# Altium schematic sheet Sheet.SchDoc
size 420 x 297 mm
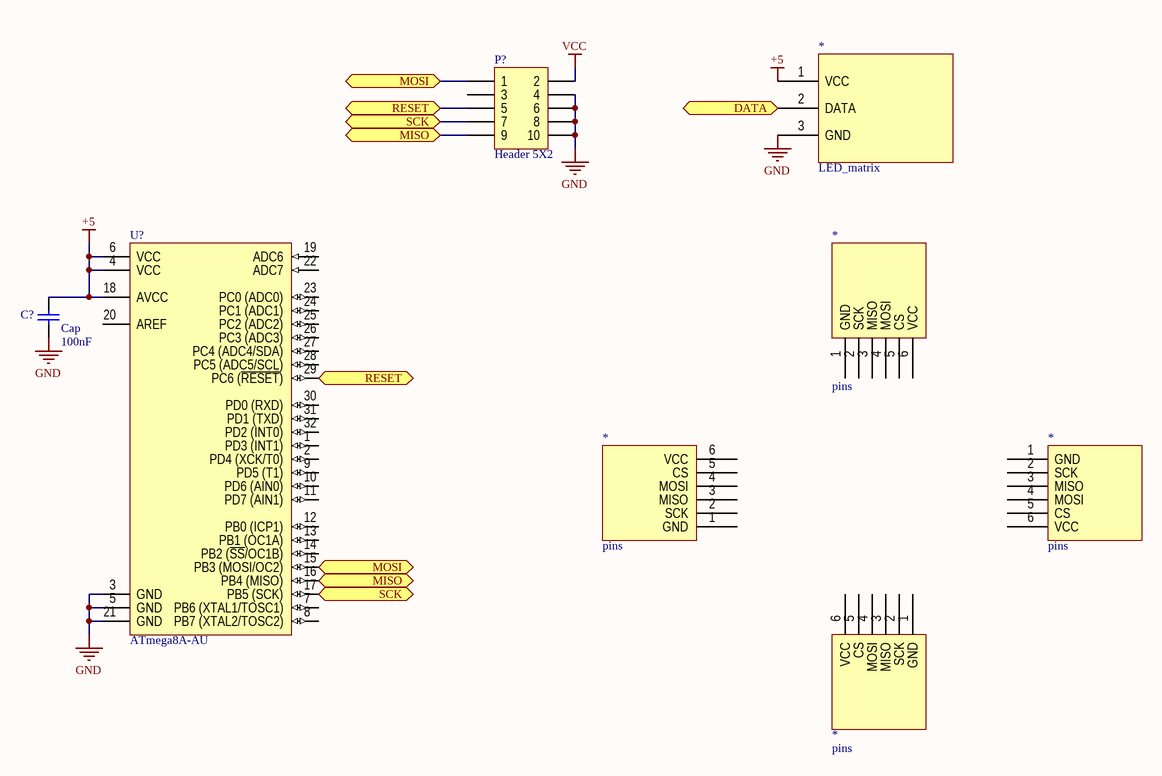
[diagram p0: Sheet.SchDoc]

## Parts
(Parts that share a designator on the sheet are numbered #1, #2 ... from top to bottom, then left to right.)
*#1  LED_matrix
*#2  pins
*#3  pins
*#4  pins
*#5  pins
C?  Cap  value 100nF  [RAD-0.3]
P?  Header 5X2  [HDR2X5]
U?  ATmega8A-AU  [32A_N]

## Ports
DATA, MISO, MOSI, RESET, SCK

## Nets
+5: *#1.1(VCC) C?.2 U?.4(VCC) U?.6(VCC) U?.18(AVCC)
GND: *#1.3(GND) C?.1 P?.4 P?.6 P?.8 P?.10 U?.3(GND) U?.5(GND) U?.21(GND)
VCC: P?.2
DATA: *#1.2(DATA) ; port DATA
MISO: P?.9 U?.16(PB4_(MISO)) ; port MISO
MOSI: P?.1 U?.15(PB3_(MOSI/OC2)) ; port MOSI
RESET: P?.5 U?.29(PC6_(~{RESET})) ; port RESET
SCK: P?.7 U?.17(PB5_(SCK)) ; port SCK

Not connected (* = marked no-connect by the designer): *#2 1(GND) 2(SCK) 3(MISO) 4(MOSI) 5(CS) 6(VCC); *#3 1(GND) 2(SCK) 3(MISO) 4(MOSI) 5(CS) 6(VCC); *#4 1(GND) 2(SCK) 3(MISO) 4(MOSI) 5(CS) 6(VCC); *#5 1(GND) 2(SCK) 3(MISO) 4(MOSI) 5(CS) 6(VCC); P? 3; U? 1(PD3_(INT1)) 2(PD4_(XCK/T0)) 7(PB6_(XTAL1/TOSC1)) 8(PB7_(XTAL2/TOSC2)) 9(PD5_(T1)) 10(PD6_(AIN0)) 11(PD7_(AIN1)) 12(PB0_(ICP1)) 13(PB1_(OC1A)) 14(PB2_(~{SS}/OC1B)) 19(ADC6) 20(AREF) 22(ADC7) 23(PC0_(ADC0)) 24(PC1_(ADC1)) 25(PC2_(ADC2)) 26(PC3_(ADC3)) 27(PC4_(ADC4/SDA)) 28(PC5_(ADC5/SCL)) 30(PD0_(RXD)) 31(PD1_(TXD)) 32(PD2_(INT0))

## Notes on the sheet
- Ïîäï. è äàòà
- Èíâ. ¹ äóáë.
- Âçàì. èíâ. ¹
- Èíâ. ¹ ïîäë.
- Èçì.
- Ëèñò
- ¹ äîêóì.
- Ïîäï.
- Äàòà
- 2.106-A3
- Êîïèðîâàë
- Ôîðìàò À3

## Library data of the parts
C? = Cap: Capacitor; Published: 8-Jun-2000; LatestRevisionDate: 17-Jul-2002; LatestRevisionNote: Re-released for DXP Platform.; PackageReference: RAD-0.3; Publisher: Altium Limited; PackageDescription: Radial Cap, Thru-Hole; 2 Leads; 0.3 in Pin Spacing
P? = Header 5X2: Header, 5-Pin, Dual row; LatestRevisionDate: 17-Jul-2002; LatestRevisionNote: Re-released for DXP Platform.; Publisher: Altium Limited
U? = ATmega8A-AU: 8-bit AVR Microcontroller, 8KB Flash, 512 Bytes EEPROM, 1KB SRAM, 32-pin TQFP, Industrial Grade (-40°C to 85°C); Published: 1-Apr-2010; DatasheetVersion: revC, Jul-2009; PackageVersion: revB, Oct-2001; PackageReference: 32A; Publisher: Altium Limited; PackageDescription: 32-Lead, 7x7x1.0 mm Body, 0.8mm Lead Pitch, Thin Profile Plastic Quad Flat Package (TQFP); Supplier 1: Digi-Key; Supplier Part Number 1: ATMEGA8A-AU-ND; Supplier 2: Farnell; Supplier Part Number 2: 1748532; Supplier 3: Mouser; Supplier Part Number 3: 556-ATMEGA8A-AU; Code_JEDEC: MS-026-ABA; ComponentLink1Description: Manufacturer Link; ComponentLink1URL: http://www.atmel.com/products/avr/default.asp?; ComponentLink2Description: ATmega8A Datasheet; ComponentLink2URL: http://www.atmel.com/dyn/resources/prod_documents/doc8159.pdf; ComponentLink3Description: ATmega8A Summary; ComponentLink3URL: http://www.atmel.com/dyn/resources/prod_documents/8159S.pdf; ComponentLink4Description: Atmel.com Home; ComponentLink4URL: http://www.atmel.com